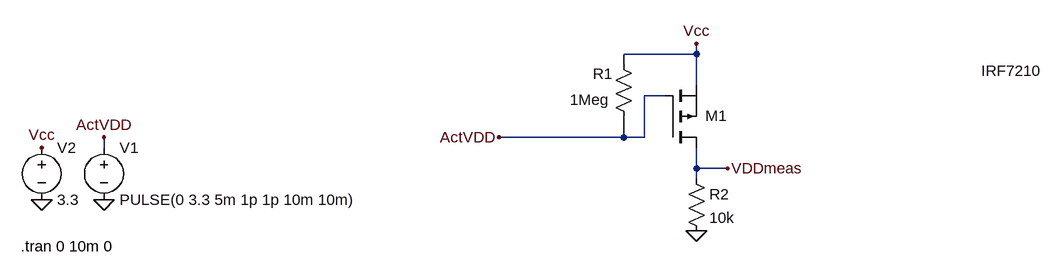
[diagram p0: schematic MOSFETCiruitEnable.asc]
MOSFETCiruitEnable.asc, the LTspice schematic file:
Version 4
SHEET 1 880 680
WIRE 288 64 288 48
WIRE 288 64 176 64
WIRE 176 80 176 64
WIRE 288 112 288 64
WIRE 240 128 208 128
WIRE 176 192 176 160
WIRE 176 192 -16 192
WIRE 208 192 208 128
WIRE 208 192 176 192
WIRE -624 208 -624 192
WIRE 288 240 288 208
WIRE 336 240 288 240
WIRE 288 256 288 240
FLAG 336 240 VDDmeas
FLAG 288 336 0
FLAG 288 48 Vcc
FLAG -720 208 Vcc
FLAG -720 288 0
FLAG -624 288 0
FLAG -624 192 ActVDD
FLAG -16 192 ActVDD
SYMBOL res 160 64 R0
WINDOW 0 -31 30 Left 2
WINDOW 3 -67 70 Left 2
SYMATTR InstName R1
SYMATTR Value 1Meg
SYMBOL pmos 240 208 M180
WINDOW 0 62 49 Left 2
WINDOW 3 486 118 Left 2
SYMATTR InstName M1
SYMATTR Value IRF7210
SYMBOL res 272 240 R0
SYMATTR InstName R2
SYMATTR Value 10k
SYMBOL voltage -624 192 R0
WINDOW 123 0 0 Left 2
WINDOW 39 0 0 Left 2
SYMATTR InstName V1
SYMATTR Value PULSE(0 3.3 5m 1p 1p 10m 10m)
SYMBOL voltage -720 192 R0
WINDOW 123 0 0 Left 2
WINDOW 39 0 0 Left 2
SYMATTR InstName V2
SYMATTR Value 3.3
TEXT -752 360 Left 2 !.tran 0 10m 0

The netlist it stands for:
* MOSFETCiruitEnable.asc
R1 Vcc ActVDD 1Meg
M1 VDDmeas ActVDD Vcc Vcc IRF7210
R2 VDDmeas 0 10k
V1 ActVDD 0 PULSE(0 3.3 5m 1p 1p 10m 10m)
V2 Vcc 0 3.3
.model NMOS NMOS
.model PMOS PMOS
.lib standard.mos
.tran 0 10m 0
.backanno
.end

* Results of the author's LTspice run, read from the files saved beside the schematic
* Operating Point, zero values left out:
*   V(vcc) = 3.3 V
*   V(vddmeas) = 3.3 V
*   Id(M1) = -330 µA
*   Is(M1) = 330 µA
*   I(R2) = 330 µA
*   I(R1) = 3.3 µA
*   I(V2) = -333.3 µA
*   I(V1) = 3.3 µA
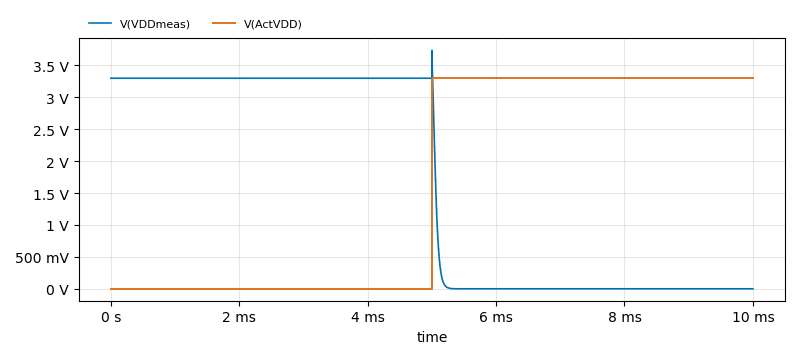
[diagram p1: Transient Analysis of MOSFETCiruitEnable.asc, plotted from the saved traces]
* Transient Analysis, 1 run:
*   V(VDDmeas): min 14.61 µV, max 3.737 V, average 1.673 V, rms 2.344 V, last 14.61 µV
*   V(ActVDD): min 0 V, max 3.3 V, average 1.65 V, rms 2.333 V, last 3.3 V